# Altium project Blue Tractor_v1.1-2021.PrjPCB (part 1 of 2)
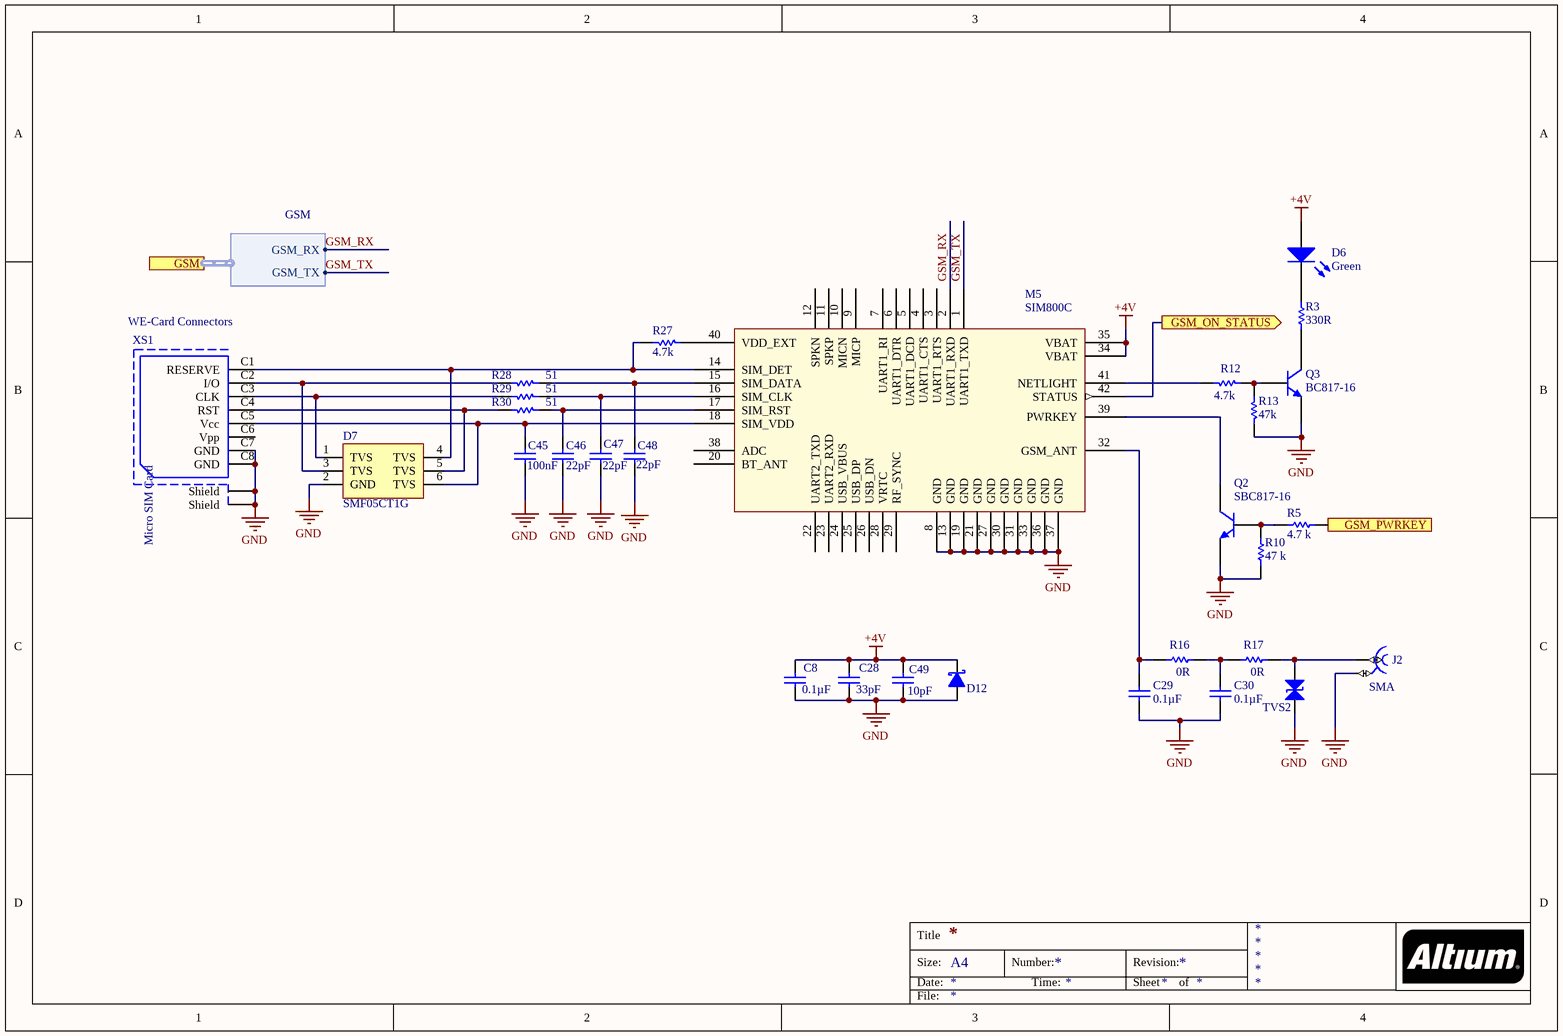
[diagram p0: [02] - GSM.SchDoc]
7 sheets, 95 parts. Net scope: global (net labels, ports and power ports of the same name join across sheets).
Board file: Blue Tractor_v3.3-2022.PcbDoc
Sheets:
  [02] - GSM.SchDoc
  [03] - WiFi.SchDoc
  [05] - Sensors.SchDoc
  [06] - IO_Ports.SchDoc
  [07] - SD.SchDoc
  [09] - EMC-Power.SchDoc
  [12] - RTC.SchDoc

## Sheet [02] - GSM.SchDoc
size A4

### Parts
C8  Capacitance: 0.1µF  [0603_C]  (hidden comment: Capacitor)
C28  Capacitance: 33pF  [0603_C]  (hidden comment: Capacitor)
C29  Capacitance: 0.1µF  [0603_C]  (hidden comment: Capacitor)
C30  Capacitance: 0.1µF  [0603_C]  (hidden comment: Capacitor)
C45  Capacitance: 100nF  [0603_C]  (hidden comment: Capacitor)
C46  Capacitance: 22pF  [0603_C]  (hidden comment: Capacitor)
C47  Capacitance: 22pF  [0603_C]  (hidden comment: Capacitor)
C48  Capacitance: 22pF  [0603_C]  (hidden comment: Capacitor)
C49  Capacitance: 10pF  [0603_C]  (hidden comment: Capacitor)
D6  Colour: Green  [Led 0805 green]  (hidden comment: LED)
D7  SMF05CT1G  [? TVS SMF05CT]
D12  D Schottky_1  [SOD-323]  (value not drawn)
J2  SMA  [AMPHENOL_132134]
M5  SIM800C  [GSM SIM800C]
Q2  SBC817-16  [SOT23-3]
Q3  BC817-16  [SOT23-3]
R3  Resistance: 330R  [0603_R]  (hidden comment: Res1)
R5  Resistance: 4.7 k  [0603_R]  (hidden comment: Res1)
R10  Resistance: 47 k  [0603_R]  (hidden comment: Res1)
R12  Resistance: 4.7k  [0603_R]  (hidden comment: Res1)
R13  Resistance: 47k  [0603_R]  (hidden comment: Res1)
R16  Resistance: 0R  [0603_R]  (hidden comment: Res1)
R17  Resistance: 0R  [0603_R]  (hidden comment: Res1)
R27  Resistance: 4.7k  [0603_R]  (hidden comment: Res1)
R28  Resistance: 51  [0603_R]  (hidden comment: Res1)
R29  Resistance: 51  [0603_R]  (hidden comment: Res1)
R30  Resistance: 51  [0603_R]  (hidden comment: Res1)
TVS2  LXE15AAA1-153  [LXES15_MUR-L]  (value not drawn)
XS1  WE-Card Connectors  [693022010811]

### Ports
GSM (harness GSM), GSM_ON_STATUS (out), GSM_PWRKEY (in)

### Harnesses
GSM: GSM_RX, GSM_TX

### Nets
+4V: C8.2 C28.2 C49.2 D6.1(A) D12.1(K) M5.34(VBAT) M5.35(VBAT)
GND: C8.1 C28.1 C29.1 C30.1 C45.1 C46.1 C47.1 C48.1 C49.1 D7.2(GND) D12.2(A) J2.2 M5.8(GND) M5.13(GND) M5.19(GND) M5.21(GND) M5.27(GND) M5.30(GND) M5.31(GND) M5.33(GND) M5.36(GND) M5.37(GND) Q2.2(E) Q3.2(E) R10.1 R13.1 TVS2.1 XS1.C7(GND) XS1.C8(GND) XS1.Z1(Shield) XS1.Z2(Shield)
GSM_RX: M5.2(UART1_RXD) ; port GSM.GSM_RX
GSM_TX: M5.1(UART1_TXD) ; port GSM.GSM_TX
NetC29_2: C29.2 M5.32(GSM_ANT) R16.2
NetC30_2: C30.2 R16.1 R17.2
NetC45_2: C45.2 D7.6(TVS) M5.18(SIM_VDD) XS1.C5(Vcc)
NetC46_2: C46.2 M5.17(SIM_RST) R30.1
NetC47_2: C47.2 M5.16(SIM_CLK) R29.1
NetC48_2: C48.2 M5.15(SIM_DATA) R28.1
NetD6_2: D6.2(K) R3.2
NetD7_1: D7.1(TVS) R29.2 XS1.C3(CLK)
NetD7_3: D7.3(TVS) R28.2 XS1.C2(I/O)
NetD7_4: D7.4(TVS) M5.14(SIM_DET) R27.2 XS1.C1(RESERVE)
NetD7_5: D7.5(TVS) R30.2 XS1.C4(RST)
NetJ2_1: J2.1 R17.1 TVS2.2
NetM5_39: M5.39(PWRKEY) Q2.3(C)
NetM5_40: M5.40(VDD_EXT) R27.1
NetM5_41: M5.41(NETLIGHT) R12.1
NetM5_42: M5.42(STATUS) ; port GSM_ON_STATUS
NetQ2_1: Q2.1(B) R5.1 R10.2
NetQ3_1: Q3.1(B) R12.2 R13.2
NetQ3_3: Q3.3(C) R3.1
NetR5_2: R5.2 ; port GSM_PWRKEY

Not connected (* = marked no-connect by the designer): M5 3(UART1_RTS) 4(UART1_CTS) 5(UART1_DCD) 6(UART1_DTR) 7(UART1_RI) 9(MICP) 10(MICN) 11(SPKP) 12(SPKN) 20(BT_ANT) 22(UART2_TXD) 23(UART2_RXD) 24(USB_VBUS) 25(USB_DP) 26(USB_DN) 28(VRTC) 29(RF_SYNC) 38(ADC); XS1 C6(Vpp)

### Notes on the sheet
- Title
- Size:
- Date:
- A4
- Number:
- Time:
- Revision:
- Sheet
- of
- File:
- (in symbol WE-Card Connectors 693022010811) Micro SIM Card

### Library data of the parts
C8 C28-C30 C45-C49 = 1: Chip Capacitor Nonpolar; Manufacturer: Kemet; Manufacturer Part Number: C0603C104K5RACTU; Tolerance: ±10%; Voltage - Rated: 50V; Temperature Coefficient: X7R; Supplier 1: Digi-Key; Supplier Part Number 1: 399-5089-1-ND; RoHS: RoHS Compliant; Category: Capacitors; Stock 1: 3992655; Pricing 1: 1=0.1, 10=0.041, 50=0.0222, 100=0.0187, 250=0.01532, 500=0.0131, 1000=0.0102 (USD); Packaging: Cut Tape (CT); Mounting Type: Surface Mount, MLCC; Operating Temperature: -55°C ~ 125°C; Applications: General Purpose; Ratings: -; Package / Case: 0603 (1608 Metric); Size / Dimension: 0.063" L x 0.031" W (1.60mm x 0.80mm); Height - Seated (Max): -; Thickness (Max): 0.034" (0.87mm); Lead Spacing: -; Features: -; Lead Style: -; ComponentLink1URL: http://www.kemet.com/docfinder?Partnumber=C0603C104K5RACTU; ComponentLink1Description: http://www.kemet.com/docfinder?Partnumber=C0603C104K5RACTU
D6 = 3: Led 0805; Manufacturer: Vishay Lite-On; Manufacturer Part Number: LTST-S220GKT; ID: 3; Lens Colour: Clear,Colorless; Viewing Angle: 130°; Lens Style: Clear,Diffused,Colorless,Rectangular; Luminous Intensity: 10mcd; Forward Voltage: 2.1V; Forward Current: 30mA; Power Rating: 100mW; Dominant Wavelength: 569nm; Test Current: 20mA; Lens Transparency: Clear; Number of Elements: 1; Wavelength: 565nm; Reverse Voltage: 5V; Supplier 1: Digi-Key; Supplier Part Number 1: 160-1218-6-ND; Stock 1: 87001; Pricing 1: 1=0.27, 10=0.199, 25=0.1464, 100=0.1045, 250=0.07108, 500=0.0627, 1000=0.04912 (USD); Mount: Surface Mount; Case/Package: 0805; Number of Pins: 2; Case Code (Metric): 2012; Case Code (Imperial): 0805; Min Operating Temperature: -55°C; Max Operating Temperature: 85°C; Package Quantity: 1; Packaging: Tape and Reel; Illumination Colour: Green; Power Dissipation: 100mW; Number of LEDs: 1; Length: 2.1mm; Height: 0.6mm; Width: 1mm; Depth: 0.6mm; Radiation Hardening: No; Lead Free: Lead Free; ComponentLink1URL: https://datasheet.ciiva.com/2110/ltst-s220gkt-2110016.pdf; ComponentLink1Description: https://datasheet.ciiva.com/2110/ltst-s220gkt-2110016.pdf; ComponentLink2URL: https://datasheet.ciiva.com/11775/0900766b80dc0b6e-11775442.pdf; ComponentLink2Description: https://datasheet.ciiva.com/11775/0900766b80dc0b6e-11775442.pdf; ComponentLink3URL: https://datasheet.ciiva.com/15118/getdatasheetpartid-221136-15118117.pdf; ComponentLink3Description: https://datasheet.ciiva.com/15118/getdatasheetpartid-221136-15118117.pdf; ComponentLink4URL: https://datasheet.ciiva.com/2110/ltst-s220gkt-2110017.pdf; ComponentLink4Description: https://datasheet.ciiva.com/2110/ltst-s220gkt-2110017.pdf; ComponentLink5URL: https://datasheet.ciiva.com/16444/ltst-s220gkt-16444773.pdf; ComponentLink5Description: https://datasheet.ciiva.com/16444/ltst-s220gkt-16444773.pdf
D7 = SMF05CT1G: 5-Line Transient Voltage  Suppressor Array; Manufacturer: ON Semiconductor; Type: Zener; Unidirectional Channels: 5; Voltage - Reverse Standoff (Typ): 5V (Max); Voltage - Breakdown (Min): 6.2V; Voltage - Clamping (Max) @ Ipp: 12.5V; Current - Peak Pulse (10/1000µs): 8A (8/20µs); Power - Peak Pulse: 100W; Power Line Protection: No; Capacitance @ Frequency: 80pF @ 1MHz; Supplier 1: Digi-Key; Supplier Part Number 1: SMF05CT1GOSCT-ND; Manufacturer Part Number: SMF05CT1G; RoHS: RoHS Compliant; Category: Circuit Protection; Stock 1: 13951; Pricing 1: 1=0.59, 10=0.413, 25=0.3392, 100=0.2709, 250=0.19736, 500=0.16026, 1000=0.12319 (USD); Packaging: Cut Tape (CT); Bidirectional Channels: -; Applications: General Purpose; Operating Temperature: -40°C ~ 125°C; Mounting Type: Surface Mount; Package / Case: 6-TSSOP, SC-88, SOT-363; Supplier Device Package: SC-88/SC70-6/SOT-363; ComponentLink1URL: http://www.onsemi.com/pub_link/Collateral/SMF05C-D.PDF; ComponentLink1Description: http://www.onsemi.com/pub_link/Collateral/SMF05C-D.PDF
D12 = D Schottky_1: SMAZ16-13-F; Manufacturer: Diodes Incorporated; Pd - Power Dissipation: 1 W; Vz - Zener Voltage: 16 V; Zener Current: 0.5 uA; Manufacturer Part Number: SMAZ16-13-F; Maximum Operating Temperature: + 150 C; Minimum Operating Temperature: - 65 C; Package / Case: SMA-2; Mounting Style: SMD/SMT; Product Category: Zener Diodes; Supplier Part Number: SMAZ16-FDICT-ND
J2 = AMPHENOL_132134: Manufacturer: TE Connectivity; Manufacturer Part Number: 5-1814832-1; Body Material: Zinc; Plating: Nickel; Body Plating: Gold; Dielectric Material: PTFE; Impedance: 50R; Frequency: 3GHz; Gender: Female; Connector Type: Jack,SMA; Polarity: Normal; Wire/Cable Type: Coaxial; Insulation Resistance: 5GR; Connector System: Cable-to-Board; Number of Positions: 1; Sealable: No (Without); Tail Length: 4mm; Family: SMA; Author: CERN DEM JLC; Supplier 1: Digi-Key; Supplier Part Number 1: A97594-ND; Stock 1: 20161; Pricing 1: 1=2.21, 10=2.121, 25=1.944, 50=1.8556, 100=1.7673, 250=1.54636, 500=1.50218, 1000=1.32545 (USD); Mount: PCB,Through Hole; Case/Package: SMA; Contact Material: Bronze; Contact Plating: Gold; Insulation Material: Polytetrafluoroethylene; Min Operating Temperature: -67°C; Max Operating Temperature: 185°C; Package Quantity: 1; Fastening Type: Threaded; Packaging: Box; Termination: Through Hole; Max Frequency: 3GHz; Orientation: Straight; Length: 0.532inch; Depth: 6.4mm; Radiation Hardening: No; REACH SVHC: No SVHC; Lead Free: Lead Free; ELV: Compliant
M5 = SIM800C: GSM/GPS module
Q2 Q3 = BC817-16: NPN General-purpose Transistor; Manufacturer: ON Semiconductor; Manufacturer Part Number: BC817-16LT3G; hFE Min: 100; Max Power Dissipation: 300mW; Collector Emitter Voltage (VCEO): 45V; Max Collector Current: 500mA; Transition Frequency: 100MHz; Collector Base Voltage (VCBO): 50V; Emitter Base Voltage (VEBO): 5V; Collector Emitter Saturation Voltage: 700mV; Element Configuration: Single; Number of Elements: 1; ComponentLink1URL: http://www.mccsemi.com/up_pdf/BC817-16~BC817-40(SOT-23).pdf; ComponentLink1Description: http://www.mccsemi.com/up_pdf/BC817-16~BC817-40(SOT-23).pdf; Supplier 1: Digi-Key; Supplier Part Number 1: BC817-16LT3GOSDKR-ND; Stock 1: 22032; Pricing 1: 1=0.13, 10=0.121, 100=0.0658, 500=0.04048, 1000=0.02759 (USD); Case/Package: SOT-23-3; Number of Pins: 3; Contact Plating: Tin,Matte; Min Operating Temperature: -55°C; Max Operating Temperature: 150°C; Package Quantity: 10000; Packaging: Tape and Reel; Collector Emitter Breakdown Voltage: 45V; Polarity: NPN; Power Dissipation: 300mW; Frequency: 100MHz; Max Breakdown Voltage: 45V; Gain Bandwidth Product: 100MHz; Radiation Hardening: No; Lead Free: Lead Free; Halogen Free: Halogen Free; ComponentLink2URL: https://datasheet.ciiva.com/15139/getdatasheetpartid-84401-15139109.pdf; ComponentLink2Description: https://datasheet.ciiva.com/15139/getdatasheetpartid-84401-15139109.pdf; ComponentLink3URL: https://datasheet.ciiva.com/980/bc817-16lt1-d-980715.pdf; ComponentLink3Description: https://datasheet.ciiva.com/980/bc817-16lt1-d-980715.pdf; ComponentLink4URL: https://datasheet.ciiva.com/26115/bc817-16lt1-d-26115598.pdf; ComponentLink4Description: https://datasheet.ciiva.com/26115/bc817-16lt1-d-26115598.pdf; ComponentLink5URL: https://datasheet.ciiva.com/11204/bc817-16lt1-d-11204335.pdf; ComponentLink5Description: https://datasheet.ciiva.com/11204/bc817-16lt1-d-11204335.pdf
R3 = Res1: Chip Resistor; Manufacturer: Panasonic; Manufacturer Part Number: ERJ-3GEYJ103V; Tolerance: 5%; Power Rating: 100mW; Voltage Rating: 75V; Temperature Coefficient: 200ppm/°C; Voltage Rating (DC): 50V; Supplier 1: Digi-Key; Supplier Part Number 1: P10KGDKR-ND; Stock 1: 10740434; Pricing 1: 1=0.1, 10=0.054, 100=0.022, 1000=0.00988, 2500=0.00858 (USD); Mount: Surface Mount; Case/Package: 0603; Weight: 7.1E-05oz; Case Code (Imperial): 0603; Case Code (Metric): 1608; Contact Plating: Tin; Min Operating Temperature: -55°C; Max Operating Temperature: 155°C; Packaging: Tape and Reel; Package Quantity: 1; Composition: Thick Film; Termination: SMD/SMT; Number of Terminations: 2; Military Standard: Not; Max Power Dissipation: 100mW; Working Voltage: 75V; Features: Automotive AEC-Q200; Length: 1.6mm; Height: 0.45mm; Width: 0.8mm; Depth: 0.8mm; REACH SVHC: No SVHC; Lead Free: Lead Free; ComponentLink1URL: https://datasheet.ciiva.com/34303/2007265-34303757.pdf; ComponentLink1Description: https://datasheet.ciiva.com/34303/2007265-34303757.pdf; ComponentLink2URL: https://datasheet.ciiva.com/11809/0900766b80f806dd-11809566.pdf; ComponentLink2Description: https://datasheet.ciiva.com/11809/0900766b80f806dd-11809566.pdf; ComponentLink3URL: https://datasheet.ciiva.com/28514/1678796-28514213.pdf; ComponentLink3Description: https://datasheet.ciiva.com/28514/1678796-28514213.pdf; ComponentLink4URL: https://datasheet.ciiva.com/30147/4aoa0000ce1-30147029.pdf; ComponentLink4Description: https://datasheet.ciiva.com/30147/4aoa0000ce1-30147029.pdf; ComponentLink5URL: https://datasheet.ciiva.com/46371/1678796-46371909.pdf; ComponentLink5Description: https://datasheet.ciiva.com/46371/1678796-46371909.pdf; ComponentLink6URL: https://datasheet.ciiva.com/24133/aoa0000ce1-37422-24133064.pdf; ComponentLink6Description: https://datasheet.ciiva.com/24133/aoa0000ce1-37422-24133064.pdf; ComponentLink7URL: https://datasheet.ciiva.com/46385/1678796-46385240.pdf; ComponentLink7Description: https://datasheet.ciiva.com/46385/1678796-46385240.pdf; ComponentLink8URL: https://datasheet.ciiva.com/17212/aoa0000ce1-17212106.pdf; ComponentLink8Description: https://datasheet.ciiva.com/17212/aoa0000ce1-17212106.pdf; ComponentLink9URL: https://datasheet.ciiva.com/9117/aoa0000ce1-9117038.pdf; ComponentLink9Description: https://datasheet.ciiva.com/9117/aoa0000ce1-9117038.pdf; ComponentLink10URL: https://datasheet.ciiva.com/16740/aoa0000ce1-16740655.pdf; ComponentLink10Description: https://datasheet.ciiva.com/16740/aoa0000ce1-16740655.pdf; ComponentLink11URL: https://datasheet.ciiva.com/48531/aoa0000ce1-48531887.pdf; ComponentLink11Description: https://datasheet.ciiva.com/48531/aoa0000ce1-48531887.pdf
R5 R10 = 1: Chip Resistor; Manufacturer: Panasonic; Manufacturer Part Number: ERJ-3GEYJ103V; Tolerance: 5%; Power Rating: 100mW; Voltage Rating: 75V; Temperature Coefficient: 200ppm/°C; Voltage Rating (DC): 50V; Supplier 1: Digi-Key; Supplier Part Number 1: P10KGDKR-ND; Stock 1: 10740434; Pricing 1: 1=0.1, 10=0.054, 100=0.022, 1000=0.00988, 2500=0.00858 (USD); Mount: Surface Mount; Case/Package: 0603; Weight: 7.1E-05oz; Case Code (Imperial): 0603; Case Code (Metric): 1608; Contact Plating: Tin; Min Operating Temperature: -55°C; Max Operating Temperature: 155°C; Packaging: Tape and Reel; Package Quantity: 1; Composition: Thick Film; Termination: SMD/SMT; Number of Terminations: 2; Military Standard: Not; Max Power Dissipation: 100mW; Working Voltage: 75V; Features: Automotive AEC-Q200; Length: 1.6mm; Height: 0.45mm; Width: 0.8mm; Depth: 0.8mm; REACH SVHC: No SVHC; Lead Free: Lead Free; ComponentLink1URL: https://datasheet.ciiva.com/34303/2007265-34303757.pdf; ComponentLink1Description: https://datasheet.ciiva.com/34303/2007265-34303757.pdf; ComponentLink2URL: https://datasheet.ciiva.com/11809/0900766b80f806dd-11809566.pdf; ComponentLink2Description: https://datasheet.ciiva.com/11809/0900766b80f806dd-11809566.pdf; ComponentLink3URL: https://datasheet.ciiva.com/28514/1678796-28514213.pdf; ComponentLink3Description: https://datasheet.ciiva.com/28514/1678796-28514213.pdf; ComponentLink4URL: https://datasheet.ciiva.com/30147/4aoa0000ce1-30147029.pdf; ComponentLink4Description: https://datasheet.ciiva.com/30147/4aoa0000ce1-30147029.pdf; ComponentLink5URL: https://datasheet.ciiva.com/46371/1678796-46371909.pdf; ComponentLink5Description: https://datasheet.ciiva.com/46371/1678796-46371909.pdf; ComponentLink6URL: https://datasheet.ciiva.com/24133/aoa0000ce1-37422-24133064.pdf; ComponentLink6Description: https://datasheet.ciiva.com/24133/aoa0000ce1-37422-24133064.pdf; ComponentLink7URL: https://datasheet.ciiva.com/46385/1678796-46385240.pdf; ComponentLink7Description: https://datasheet.ciiva.com/46385/1678796-46385240.pdf; ComponentLink8URL: https://datasheet.ciiva.com/17212/aoa0000ce1-17212106.pdf; ComponentLink8Description: https://datasheet.ciiva.com/17212/aoa0000ce1-17212106.pdf; ComponentLink9URL: https://datasheet.ciiva.com/9117/aoa0000ce1-9117038.pdf; ComponentLink9Description: https://datasheet.ciiva.com/9117/aoa0000ce1-9117038.pdf; ComponentLink10URL: https://datasheet.ciiva.com/16740/aoa0000ce1-16740655.pdf; ComponentLink10Description: https://datasheet.ciiva.com/16740/aoa0000ce1-16740655.pdf; ComponentLink11URL: https://datasheet.ciiva.com/48531/aoa0000ce1-48531887.pdf; ComponentLink11Description: https://datasheet.ciiva.com/48531/aoa0000ce1-48531887.pdf
R12 R13 R27-R30 = 1: Chip Resistor; Manufacturer: Panasonic; Manufacturer Part Number: ERJ-3EKF3300V; Tolerance: 1%; Power Rating: 100mW; Voltage Rating (DC): 75V; Temperature Coefficient: 100ppm/°C; ComponentLink1URL: http://industrial.panasonic.com/www-cgi/jvcr13pz.cgi?E+PZ+3+AOA0002+ERJ6ENF3000V+7+WW; ComponentLink1Description: http://industrial.panasonic.com/www-cgi/jvcr13pz.cgi?E+PZ+3+AOA0002+ERJ6ENF3000V+7+WW; Supplier 1: Digi-Key; Supplier Part Number 1: P330HDKR-ND; Stock 1: 924496; Pricing 1: 1=0.1, 10=0.079, 100=0.0323, 1000=0.01449, 2500=0.01258 (USD); Mount: Surface Mount; Case/Package: 0603; Number of Pins: 2; Weight: 7.1E-05oz; Case Code (Imperial): 0603; Case Code (Metric): 1608; Contact Plating: Tin; Min Operating Temperature: -55°C; Max Operating Temperature: 155°C; Packaging: Tape and Reel; Voltage Rating: 75V; Package Quantity: 1; Composition: Thick Film; Termination: SMD/SMT; Number of Terminations: 2; Military Standard: Not; Max Power Dissipation: 100mW; Features: Automotive AEC-Q200; Length: 1.6mm; Height: 0.022inch; Width: 0.8mm; Depth: 0.8mm; Radiation Hardening: No; REACH SVHC: No SVHC; Lead Free: Lead Free; ComponentLink2URL: https://datasheet.ciiva.com/7886/aoa0000ce2-7886729.pdf; ComponentLink2Description: https://datasheet.ciiva.com/7886/aoa0000ce2-7886729.pdf; ComponentLink3URL: https://datasheet.ciiva.com/48531/aoa0000ce2-48531001.pdf; ComponentLink3Description: https://datasheet.ciiva.com/48531/aoa0000ce2-48531001.pdf; ComponentLink4URL: https://datasheet.ciiva.com/22721/426256-22721099.pdf; ComponentLink4Description: https://datasheet.ciiva.com/22721/426256-22721099.pdf; ComponentLink5URL: https://datasheet.ciiva.com/46373/1678782-46373899.pdf; ComponentLink5Description: https://datasheet.ciiva.com/46373/1678782-46373899.pdf; ComponentLink6URL: https://datasheet.ciiva.com/9117/aoa0000ce2-9117132.pdf; ComponentLink6Description: https://datasheet.ciiva.com/9117/aoa0000ce2-9117132.pdf; ComponentLink7URL: https://datasheet.ciiva.com/46373/1678782-46373900.pdf; ComponentLink7Description: https://datasheet.ciiva.com/46373/1678782-46373900.pdf
R16 R17 = 1: Chip Resistor; Manufacturer: Panasonic; Manufacturer Part Number: ERJ-3GEY0R00V; Power Rating: 100mW; Voltage Rating: 75V; Tolerance: 0%; Temperature Coefficient: 600ppm/°C; Voltage Rating (DC): 50V; Supplier 1: Digi-Key; Supplier Part Number 1: P0.0GDKR-ND; Stock 1: 19868266; Pricing 1: 1=0.1, 10=0.053, 25=0.038, 50=0.029, 100=0.0214, 250=0.01632, 500=0.01306, 1000=0.00962 (USD); Mount: Surface Mount; Case/Package: 0603; Case Code (Metric): 1608; Case Code (Imperial): 0603; Contact Plating: Tin; Min Operating Temperature: -55°C; Max Operating Temperature: 155°C; Packaging: Tape and Reel; Package Quantity: 1; Composition: Thick Film; Number of Terminations: 2; Termination: SMD/SMT; Military Standard: Not; Max Power Dissipation: 100mW; Features: Automotive AEC-Q200; Length: 1.6mm; Height: 0.45mm; Width: 0.031inch; Depth: 0.8mm; Radiation Hardening: No; REACH SVHC: No SVHC; Lead Free: Lead Free; ComponentLink1URL: https://datasheet.ciiva.com/27055/1935748-27055113.pdf; ComponentLink1Description: https://datasheet.ciiva.com/27055/1935748-27055113.pdf; ComponentLink2URL: https://datasheet.ciiva.com/11808/0900766b80f806dd-11808207.pdf; ComponentLink2Description: https://datasheet.ciiva.com/11808/0900766b80f806dd-11808207.pdf; ComponentLink3URL: https://datasheet.ciiva.com/48532/aoa0000ce1-48532165.pdf; ComponentLink3Description: https://datasheet.ciiva.com/48532/aoa0000ce1-48532165.pdf; ComponentLink4URL: https://datasheet.ciiva.com/43460/1678796-43460647.pdf; ComponentLink4Description: https://datasheet.ciiva.com/43460/1678796-43460647.pdf; ComponentLink5URL: https://datasheet.ciiva.com/28695/1678796-28695833.pdf; ComponentLink5Description: https://datasheet.ciiva.com/28695/1678796-28695833.pdf; ComponentLink6URL: https://datasheet.ciiva.com/5959/1678796-5959707.pdf; ComponentLink6Description: https://datasheet.ciiva.com/5959/1678796-5959707.pdf; ComponentLink7URL: https://datasheet.ciiva.com/16834/aoa0000ce1-16834828.pdf; ComponentLink7Description: https://datasheet.ciiva.com/16834/aoa0000ce1-16834828.pdf; ComponentLink8URL: https://datasheet.ciiva.com/17215/aoa0000ce1-17215388.pdf; ComponentLink8Description: https://datasheet.ciiva.com/17215/aoa0000ce1-17215388.pdf; ComponentLink9URL: https://datasheet.ciiva.com/46377/1678796-46377868.pdf; ComponentLink9Description: https://datasheet.ciiva.com/46377/1678796-46377868.pdf; ComponentLink10URL: https://datasheet.ciiva.com/30199/4aoa0000ce1-30199822.pdf; ComponentLink10Description: https://datasheet.ciiva.com/30199/4aoa0000ce1-30199822.pdf; ComponentLink11URL: https://datasheet.ciiva.com/9198/aoa0000ce1-9198975.pdf; ComponentLink11Description: https://datasheet.ciiva.com/9198/aoa0000ce1-9198975.pdf; ComponentLink12URL: https://datasheet.ciiva.com/16758/70255313-16758527.pdf; ComponentLink12Description: https://datasheet.ciiva.com/16758/70255313-16758527.pdf
TVS2 = TVS-LXE15AAA1-153
XS1 = WE-Card Connectors 693022010811: WR-CRD Micro SIM_Hinge_8 pins; Manufacturer: Würth Elektronik eiSos GmbH; ComponentLink1 Description: Manufacturer; ComponentLink2 Description: Datasheet; NoPins: 8; ComponentLink1URL: http://www.we-online.de; ComponentLink2URL: http://katalog.we-online.de/em/datasheet/693022010811.pdf; Created by: Karrer Zheng; Created Date: 10/20/2014; partNo: 693022010811

## Sheet [03] - WiFi.SchDoc
size A4
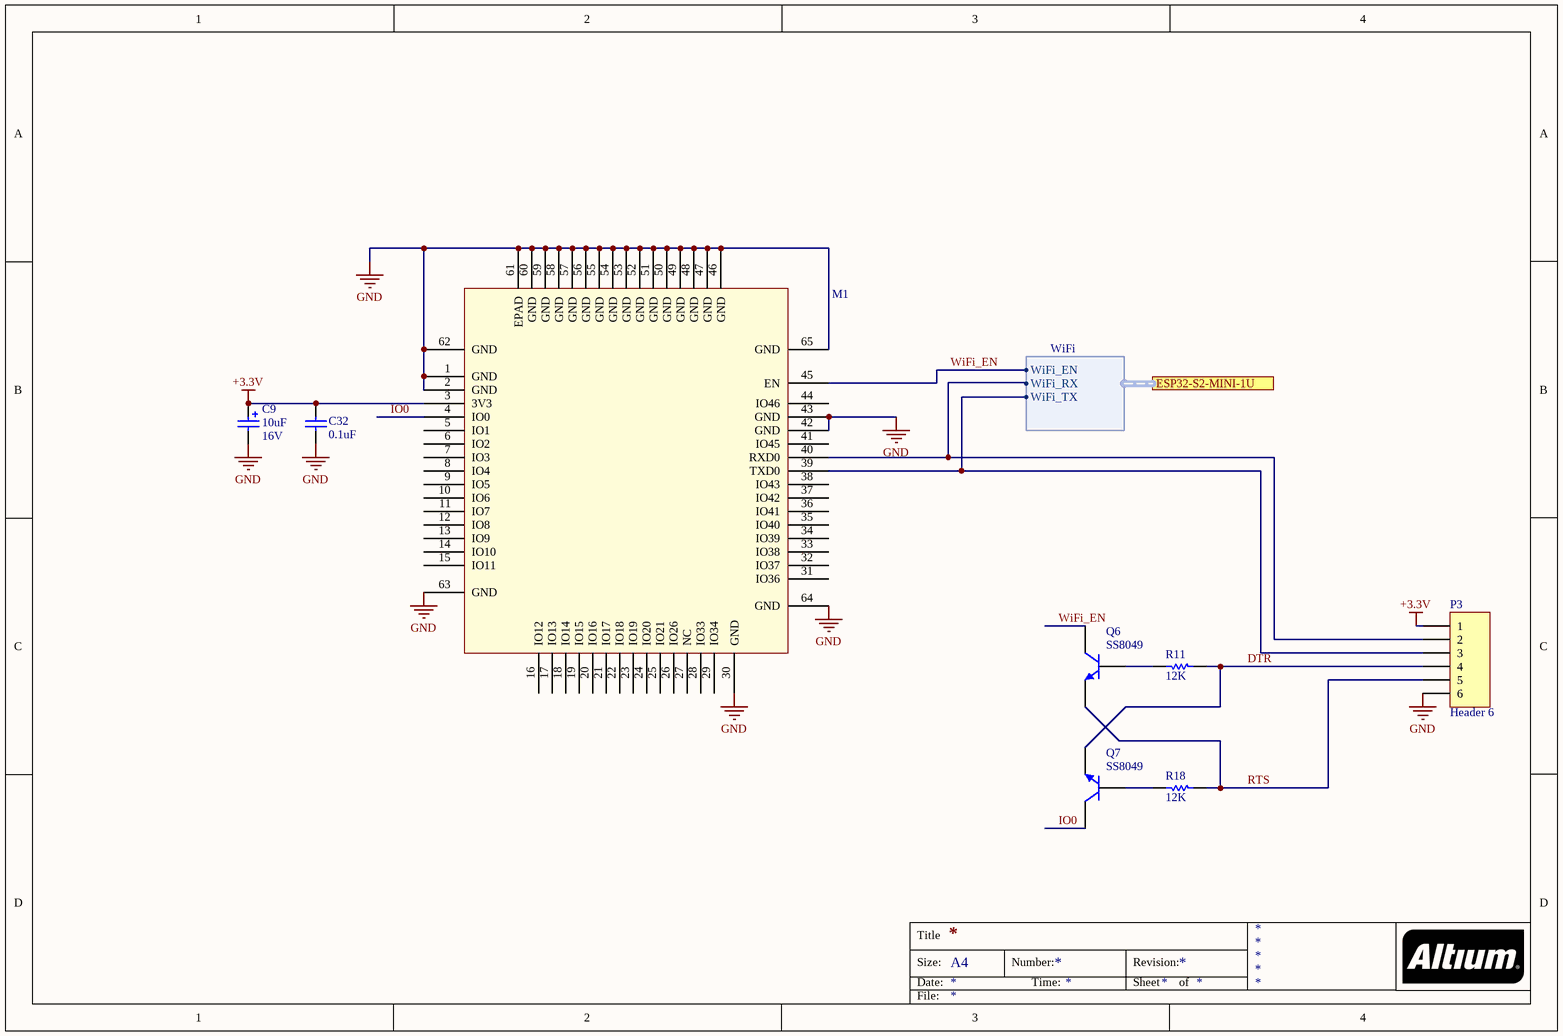
[diagram p1: [03] - WiFi.SchDoc]

### Parts
C9  Capacitance: 10uF  Voltage Rating: 16V  [Tantalum 3216 A]  (hidden comment: Capacitor Polarized)
C32  value 0.1uF  [0603_C]  (hidden comment: Cap)
M1  ESP32-S2-MINI-1U _Module  [ESP32-S2-MINI-1U]  (value not drawn)
P3  Header 6  [HDR1X6]
Q6  SS8049  [SOT23-3]
Q7  SS8049  [SOT23-3]
R11  Resistance: 12K  [Res-0603]  (hidden comment: Res1)
R18  Resistance: 12K  [Res-0603]  (hidden comment: Res1)

### Ports
ESP32-S2-MINI-1U (harness WiFi)

### Harnesses
WiFi: WiFi_EN, WiFi_RX, WiFi_TX

### Nets
+3.3V: C9.1 C32.2 M1.3(3V3) P3.1
GND: C9.2 C32.1 M1.1(GND) M1.2(GND) M1.30(GND) M1.42(GND) M1.43(GND) M1.46(GND) M1.47(GND) M1.48(GND) M1.49(GND) M1.50(GND) M1.51(GND) M1.52(GND) M1.53(GND) M1.54(GND) M1.55(GND) M1.56(GND) M1.57(GND) M1.58(GND) M1.59(GND) M1.60(GND) M1.61(EPAD) M1.62(GND) M1.63(GND) M1.64(GND) M1.65(GND) P3.6
DTR: P3.4 Q7.2(E) R11.2
IO0: M1.4(IO0) Q7.3(C)
RTS: P3.5 Q6.2(E) R18.2
WiFi_EN: M1.45(EN) Q6.3(C) ; port ESP32-S2-MINI-1U.WiFi_EN
NetM1_39: M1.39(TXD0) P3.3 ; port ESP32-S2-MINI-1U.WiFi_TX
NetM1_40: M1.40(RXD0) P3.2 ; port ESP32-S2-MINI-1U.WiFi_RX
NetQ6_1: Q6.1(B) R11.1
NetQ7_1: Q7.1(B) R18.1

Not connected (* = marked no-connect by the designer): M1 5(IO1) 6(IO2) 7(IO3) 8(IO4) 9(IO5) 10(IO6) 11(IO7) 12(IO8) 13(IO9) 14(IO10) 15(IO11) 16(IO12) 17(IO13) 18(IO14) 19(IO15) 20(IO16) 21(IO17) 22(IO18) 23(IO19) 24(IO20) 25(IO21) 26(IO26) 27(NC) 28(IO33) 29(IO34) 31(IO36) 32(IO37) 33(IO38) 34(IO39) 35(IO40) 36(IO41) 37(IO42) 38(IO43) 41(IO45) 44(IO46)

### Notes on the sheet
- Title
- Size:
- Date:
- A4
- Number:
- Time:
- Revision:
- Sheet
- of
- File:

### Library data of the parts
C9 = 2: CAP TANT 10UF 10% 16V 1206; Manufacturer: Vishay Sprague; Manufacturer Part Number: 293D106X9016A2TE3; Dielectric Material: Tantalum; ESR (Equivalent Series Resistance): 3R; Ripple Current: 160mA; Leakage Current: 1.6uA; Polarity: Polar; Dissipation Factor: 6%; Q Factor: 6; Supplier 1: Digi-Key; Supplier Part Number 1: 718-1123-1-ND; RoHS: Yes; Category: Tantalum Capacitors; Stock 1: 76138; Pricing 1: 1=0,54000, 10=0,38000, 50=0,28720, 100=0,25010, 500=0,18524, 1000=0,15745 (USD); Mount: Surface Mount,PCB; Case/Package: 1206; Case Code (Imperial): 1206; Case Code (Metric): 3216; Min Operating Temperature: -55°C; Max Operating Temperature: 125°C; Tolerance: 10%; Packaging: Tape and Reel; Package Quantity: 1; Voltage Rating (DC): 16V; Termination: SMD/SMT; Voltage: 16V; Features: General Purpose; Series: TANTAMOUNT® 293D; Length: 3.2mm; Width: 1.6mm; Height: 1.6mm; Height - Seated (Max): 0.071inch; Depth: 1.6mm; Radiation Hardening: No; REACH SVHC: Unknown; Lead Free: Lead Free; RoHS Compliant: Yes; ComponentLink1URL: https://datasheet.ciiva.com/11793/0900766b80d97b37-11793412.pdf?src-supplier=RSComponents; ComponentLink1Description: https://datasheet.ciiva.com/11793/0900766b80d97b37-11793412.pdf?src-supplier=RSComponents; ComponentLink2URL: https://datasheet.ciiva.com/257/293d-257982.pdf?src-supplier=Digi-Key; ComponentLink2Description: https://datasheet.ciiva.com/257/293d-257982.pdf?src-supplier=Digi-Key; ComponentLink3URL: https://datasheet.ciiva.com/257/293d-257983.pdf?src-supplier=Digi-Key; ComponentLink3Description: https://datasheet.ciiva.com/257/293d-257983.pdf?src-supplier=Digi-Key; ComponentLink4URL: https://datasheet.ciiva.com/1463/293d-1463155.pdf?src-supplier=Element14; ComponentLink4Description: https://datasheet.ciiva.com/1463/293d-1463155.pdf?src-supplier=Element14; ComponentLink5URL: https://datasheet.ciiva.com/3003/293d-3003829.pdf?src-supplier=Avnet; ComponentLink5Description: https://datasheet.ciiva.com/3003/293d-3003829.pdf?src-supplier=Avnet; ComponentLink6URL: https://datasheet.ciiva.com/16308/293d-16308277.pdf?src-supplier=Future+Electronics; ComponentLink6Description: https://datasheet.ciiva.com/16308/293d-16308277.pdf?src-supplier=Future+Electronics; ComponentLink7URL: https://datasheet.ciiva.com/22695/1910915-22695111.pdf?src-supplier=Element14; ComponentLink7Description: https://datasheet.ciiva.com/22695/1910915-22695111.pdf?src-supplier=Element14; ComponentLink8URL: https://datasheet.ciiva.com/257/293d-257981.pdf?src-supplier=Digi-Key; ComponentLink8Description: https://datasheet.ciiva.com/257/293d-257981.pdf?src-supplier=Digi-Key
C32 = Cap: Capacitor
M1 = ESP32-S2-MINI-1U _Module: Wi-Fi module; Datasheet: https://www.espressif.com/en/support/download/documents
P3 = Header 6: Header, 6-Pin; LatestRevisionDate: 17-Jul-2002; LatestRevisionNote: Re-released for DXP Platform.; Publisher: Altium Limited
Q6 Q7 = NPN: NPN Bipolar Transistor; Published: 8-Jun-2000; LatestRevisionDate: 17-Jul-2002; LatestRevisionNote: Re-released for DXP Platform.; PackageReference: TO-226-AA; Publisher: Altium Limited; PackageDescription: TO, Flat Index; 3 In-Line, Axial Leads; Body Dia. 4.8mm; Leads 0.55 x 0.51 mm (max); Code_JEDEC: TO-226-AA
R11 R18 = 1: Res Thkflm Anti-sulfurated 0603 100K Ohm 5% SMD; Manufacturer: Panasonic; Manufacturer Part Number: ERJ-U03J104V; Current Rating: 1A; Voltage Rating (DC): 75V; Power Rating: 100mW; Supplier 1: Digi-Key; Supplier Part Number 1: 10-ERJ-U03J104VCT-ND; Category: Chip SMD Resistors; Stock 1: 1856; Pricing 1: 1=0,10000, 10=0,07700, 100=0,02950, 1000=0,01298, 2500=0,01121 (USD); Case/Package: 0603; Weight: 7.1E-05oz; Case Code (Imperial): 0603; Case Code (Metric): 1608; Min Operating Temperature: -55°C; Max Operating Temperature: 155°C; Tolerance: 5%; Voltage Rating: 75V; Packaging: Tape and Reel; Package Quantity: 5000; Resistor Type: Thick Film; Termination: SMD/SMT; Length: 1.6mm; Width: 0.8mm; Height: 0.45mm; ComponentLink1URL: http://industrial.panasonic.com/www-cgi/jvcr13pz.cgi?E+PZ+3+AOA0005+ERJS06J821V+7+WW?src-supplier=Mouser; ComponentLink1Description: http://industrial.panasonic.com/www-cgi/jvcr13pz.cgi?E+PZ+3+AOA0005+ERJS06J821V+7+WW?src-supplier=Mouser; ComponentLink2URL: http://datasheet.octopart.com/ERJ-U03J104V-Panasonic-datasheet-61627662.pdf?src-supplier=Newark; ComponentLink2Description: http://datasheet.octopart.com/ERJ-U03J104V-Panasonic-datasheet-61627662.pdf?src-supplier=Newark; ComponentLink3URL: http://datasheet.octopart.com/ERJ-U03J104V-Panasonic-datasheet-33006993.pdf?src-supplier=Newark; ComponentLink3Description: http://datasheet.octopart.com/ERJ-U03J104V-Panasonic-datasheet-33006993.pdf?src-supplier=Newark; ComponentLink4URL: http://datasheet.octopart.com/ERJ-U03J104V-Panasonic-datasheet-78375410.pdf; ComponentLink4Description: http://datasheet.octopart.com/ERJ-U03J104V-Panasonic-datasheet-78375410.pdf

## Sheet [05] - Sensors.SchDoc
size A4
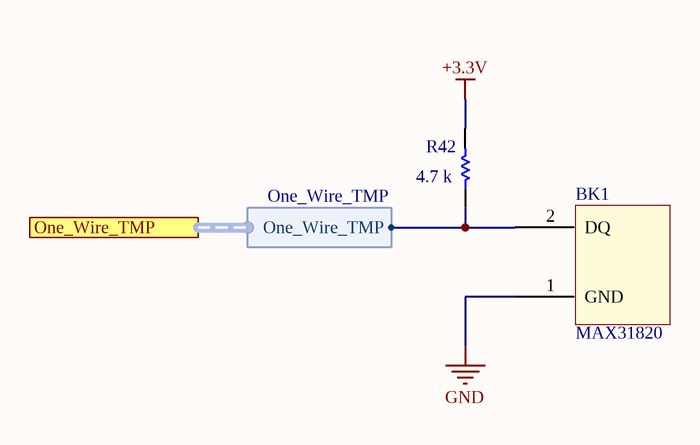
[diagram p2: [05] - Sensors.SchDoc]

### Parts
BK1  MAX31820  [TO92127P495H695-3]
R42  Resistance: 4.7 k  [0603_R]  (hidden comment: Res1)

### Ports
One_Wire_TMP (harness One_Wire_TMP)

### Harnesses
One_Wire_TMP: One_Wire_TMP

### Nets
+3.3V: R42.2
GND: BK1.1(GND)
NetBK1_2: BK1.2(DQ) R42.1 ; port One_Wire_TMP.One_Wire_TMP

### Notes on the sheet
- Title
- Size:
- Date:
- A4
- Number:
- Time:
- Revision:
- Sheet
- of
- File:

### Library data of the parts
BK1 = MAX31820: MAX31820PAR  temper sensor
R42 = 1: as R5 on sheet [02] - GSM; Supplier 1: Digi-Key; Supplier Part Number 1: P10KGDKR-ND; Stock 1: 10740434; Pricing 1: 1=0.1, 10=0.054, 100=0.022, 1000=0.00988, 2500=0.00858 (USD); Mount: Surface Mount; Case/Package: 0603; Weight: 7.1E-05oz; Case Code (Imperial): 0603; Case Code (Metric): 1608; Contact Plating: Tin; Min Operating Temperature: -55°C; Max Operating Temperature: 155°C; Packaging: Tape and Reel; Package Quantity: 1; Composition: Thick Film; Termination: SMD/SMT; Number of Terminations: 2; Military Standard: Not; Max Power Dissipation: 100mW; Working Voltage: 75V; Features: Automotive AEC-Q200; Length: 1.6mm; Height: 0.45mm; Width: 0.8mm; Depth: 0.8mm; REACH SVHC: No SVHC; Lead Free: Lead Free; ComponentLink1URL: https://datasheet.ciiva.com/34303/2007265-34303757.pdf; ComponentLink1Description: https://datasheet.ciiva.com/34303/2007265-34303757.pdf; ComponentLink2URL: https://datasheet.ciiva.com/11809/0900766b80f806dd-11809566.pdf; ComponentLink2Description: https://datasheet.ciiva.com/11809/0900766b80f806dd-11809566.pdf; ComponentLink3URL: https://datasheet.ciiva.com/28514/1678796-28514213.pdf; ComponentLink3Description: https://datasheet.ciiva.com/28514/1678796-28514213.pdf; ComponentLink4URL: https://datasheet.ciiva.com/30147/4aoa0000ce1-30147029.pdf; ComponentLink4Description: https://datasheet.ciiva.com/30147/4aoa0000ce1-30147029.pdf; ComponentLink5URL: https://datasheet.ciiva.com/46371/1678796-46371909.pdf; ComponentLink5Description: https://datasheet.ciiva.com/46371/1678796-46371909.pdf; ComponentLink6URL: https://datasheet.ciiva.com/24133/aoa0000ce1-37422-24133064.pdf; ComponentLink6Description: https://datasheet.ciiva.com/24133/aoa0000ce1-37422-24133064.pdf; ComponentLink7URL: https://datasheet.ciiva.com/46385/1678796-46385240.pdf; ComponentLink7Description: https://datasheet.ciiva.com/46385/1678796-46385240.pdf; ComponentLink8URL: https://datasheet.ciiva.com/17212/aoa0000ce1-17212106.pdf; ComponentLink8Description: https://datasheet.ciiva.com/17212/aoa0000ce1-17212106.pdf; ComponentLink9URL: https://datasheet.ciiva.com/9117/aoa0000ce1-9117038.pdf; ComponentLink9Description: https://datasheet.ciiva.com/9117/aoa0000ce1-9117038.pdf; ComponentLink10URL: https://datasheet.ciiva.com/16740/aoa0000ce1-16740655.pdf; ComponentLink10Description: https://datasheet.ciiva.com/16740/aoa0000ce1-16740655.pdf; ComponentLink11URL: https://datasheet.ciiva.com/48531/aoa0000ce1-48531887.pdf; ComponentLink11Description: https://datasheet.ciiva.com/48531/aoa0000ce1-48531887.pdf

## Sheet [06] - IO_Ports.SchDoc
size A4
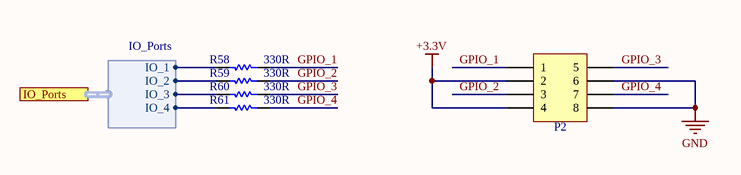
[diagram p3: [06] - IO_Ports.SchDoc]

### Parts
P2  Header 4X2A  [CON: PLD-2*4]  (value not drawn)
R58  Resistance: 330R  [0603_R]  (hidden comment: Res1)
R59  Resistance: 330R  [0603_R]  (hidden comment: Res1)
R60  Resistance: 330R  [0603_R]  (hidden comment: Res1)
R61  Resistance: 330R  [0603_R]  (hidden comment: Res1)

### Ports
IO_Ports (harness IO_Ports)

### Harnesses
IO_Ports: IO_1, IO_2, IO_3, IO_4

### Nets
+3.3V: P2.2 P2.4
GND: P2.6 P2.8
GPIO_1: P2.1 R58.2
GPIO_2: P2.3 R59.2
GPIO_3: P2.5 R60.2
GPIO_4: P2.7 R61.2
NetR58_1: R58.1 ; port IO_Ports.IO_1
NetR59_1: R59.1 ; port IO_Ports.IO_2
NetR60_1: R60.1 ; port IO_Ports.IO_3
NetR61_1: R61.1 ; port IO_Ports.IO_4

### Notes on the sheet
- Title
- Size:
- Date:
- A4
- Number:
- Time:
- Revision:
- Sheet
- of
- File:

### Library data of the parts
P2 = Header 4X2A: Header, 4-Pin, Dual row; LatestRevisionDate: 17-Jul-2002; LatestRevisionNote: Re-released for DXP Platform.; Publisher: Altium Limited
R58-R61 = 1: as R12 on sheet [02] - GSM; ComponentLink1URL: http://industrial.panasonic.com/www-cgi/jvcr13pz.cgi?E+PZ+3+AOA0002+ERJ6ENF3000V+7+WW; ComponentLink1Description: http://industrial.panasonic.com/www-cgi/jvcr13pz.cgi?E+PZ+3+AOA0002+ERJ6ENF3000V+7+WW; Supplier 1: Digi-Key; Supplier Part Number 1: P330HDKR-ND; Stock 1: 924496; Pricing 1: 1=0.1, 10=0.079, 100=0.0323, 1000=0.01449, 2500=0.01258 (USD); Mount: Surface Mount; Case/Package: 0603; Number of Pins: 2; Weight: 7.1E-05oz; Case Code (Imperial): 0603; Case Code (Metric): 1608; Contact Plating: Tin; Min Operating Temperature: -55°C; Max Operating Temperature: 155°C; Packaging: Tape and Reel; Voltage Rating: 75V; Package Quantity: 1; Composition: Thick Film; Termination: SMD/SMT; Number of Terminations: 2; Military Standard: Not; Max Power Dissipation: 100mW; Features: Automotive AEC-Q200; Length: 1.6mm; Height: 0.022inch; Width: 0.8mm; Depth: 0.8mm; Radiation Hardening: No; REACH SVHC: No SVHC; Lead Free: Lead Free; ComponentLink2URL: https://datasheet.ciiva.com/7886/aoa0000ce2-7886729.pdf; ComponentLink2Description: https://datasheet.ciiva.com/7886/aoa0000ce2-7886729.pdf; ComponentLink3URL: https://datasheet.ciiva.com/48531/aoa0000ce2-48531001.pdf; ComponentLink3Description: https://datasheet.ciiva.com/48531/aoa0000ce2-48531001.pdf; ComponentLink4URL: https://datasheet.ciiva.com/22721/426256-22721099.pdf; ComponentLink4Description: https://datasheet.ciiva.com/22721/426256-22721099.pdf; ComponentLink5URL: https://datasheet.ciiva.com/46373/1678782-46373899.pdf; ComponentLink5Description: https://datasheet.ciiva.com/46373/1678782-46373899.pdf; ComponentLink6URL: https://datasheet.ciiva.com/9117/aoa0000ce2-9117132.pdf; ComponentLink6Description: https://datasheet.ciiva.com/9117/aoa0000ce2-9117132.pdf; ComponentLink7URL: https://datasheet.ciiva.com/46373/1678782-46373900.pdf; ComponentLink7Description: https://datasheet.ciiva.com/46373/1678782-46373900.pdf

## Sheet [07] - SD.SchDoc
size A4
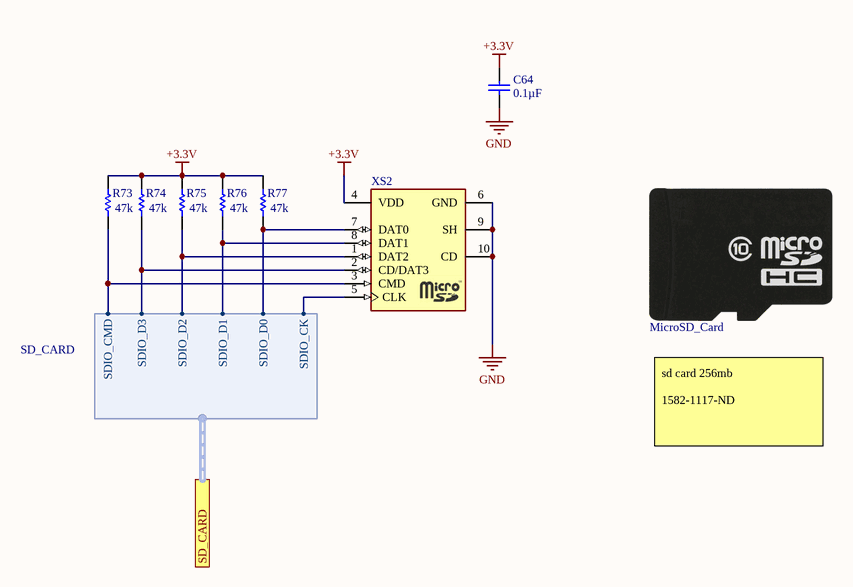
[diagram p4: [07] - SD.SchDoc]

### Parts
*1  MicroSD_Card  (mechanical)
C64  Capacitance: 0.1µF  [0603_C]  (hidden comment: Capacitor)
R73  Resistance: 47k  [0603_R]  (hidden comment: Res1)
R74  Resistance: 47k  [0603_R]  (hidden comment: Res1)
R75  Resistance: 47k  [0603_R]  (hidden comment: Res1)
R76  Resistance: 47k  [0603_R]  (hidden comment: Res1)
R77  Resistance: 47k  [0603_R]  (hidden comment: Res1)
XS2  (no value)  [MICROSD]

### Ports
SD_CARD (harness SD_CARD)

### Harnesses
SD_CARD: SDIO_CMD, SDIO_D0, SDIO_D1, SDIO_D2, SDIO_D3, SDIO_CK

### Nets
+3.3V: C64.2 R73.2 R74.2 R75.2 R76.2 R77.2 XS2.4(VDD)
GND: C64.1 XS2.6(GND) XS2.9(SH) XS2.10(CD)
NetR73_1: R73.1 XS2.3(CMD) ; port SD_CARD.SDIO_CMD
NetR74_1: R74.1 XS2.2(CD/DAT3) ; port SD_CARD.SDIO_D3
NetR75_1: R75.1 XS2.1(DAT2) ; port SD_CARD.SDIO_D2
NetR76_1: R76.1 XS2.8(DAT1) ; port SD_CARD.SDIO_D1
NetR77_1: R77.1 XS2.7(DAT0) ; port SD_CARD.SDIO_D0
NetXS2_5: XS2.5(CLK) ; port SD_CARD.SDIO_CK

### Notes on the sheet
- sd card 256mb
  1582-1117-ND
- Title
- Size:
- Date:
- A4
- Number:
- Time:
- Revision:
- Sheet
- of
- File:

### Library data of the parts
*1 = MicroSD_Card: Manufacturer: Apacer; Manufacturer Part Number: AP-MSD256ISI-1T; Supplier 1: Digi-Key; Supplier Part Number 1: 1582-1117-ND; Stock 1: 4143; Pricing 1: 1=12.85, 10=11.903, 25=11.6336, 50=11.5698, 100=10.1856, 250=9.68168, 500=9.5823, 1000=9.26289 (USD); ComponentLink1URL: http://www.mouser.com/ds/2/24/EDM_mSD(SLC)-957981.pdf; ComponentLink1Description: http://www.mouser.com/ds/2/24/EDM_mSD(SLC)-957981.pdf; ComponentLink2URL: http://eflash.apacerus.com/spec/Card/microSD/Consumer/EDM_mSD(SLC).pdf; ComponentLink2Description: http://eflash.apacerus.com/spec/Card/microSD/Consumer/EDM_mSD(SLC).pdf
C64 = 1: as C8 on sheet [02] - GSM; Supplier 1: Digi-Key; Supplier Part Number 1: 399-5089-1-ND; RoHS: RoHS Compliant; Category: Capacitors; Stock 1: 3992655; Pricing 1: 1=0.1, 10=0.041, 50=0.0222, 100=0.0187, 250=0.01532, 500=0.0131, 1000=0.0102 (USD); Packaging: Cut Tape (CT); Mounting Type: Surface Mount, MLCC; Operating Temperature: -55°C ~ 125°C; Applications: General Purpose; Ratings: -; Package / Case: 0603 (1608 Metric); Size / Dimension: 0.063" L x 0.031" W (1.60mm x 0.80mm); Height - Seated (Max): -; Thickness (Max): 0.034" (0.87mm); Lead Spacing: -; Features: -; Lead Style: -; ComponentLink1URL: http://www.kemet.com/docfinder?Partnumber=C0603C104K5RACTU; ComponentLink1Description: http://www.kemet.com/docfinder?Partnumber=C0603C104K5RACTU
R73-R77 = 1: Chip Resistor; Manufacturer: Panasonic; Manufacturer Part Number: ERJ-3EKF4702V; Tolerance: 1%; Power Rating: 100mW; Voltage Rating: 75V; Temperature Coefficient: 100ppm/°C; Working Voltage: 6V; Supplier 1: Digi-Key; Supplier Part Number 1: P47.0KHDKR-ND; Stock 1: 2918345; Pricing 1: 1=0.1, 10=0.079, 100=0.0323, 1000=0.01449, 2500=0.01258 (USD); Mount: Surface Mount; Case/Package: 0603; Number of Pins: 2; Case Code (Metric): 1608; Case Code (Imperial): 0603; Contact Plating: Tin; Min Operating Temperature: -55°C; Max Operating Temperature: 155°C; Packaging: Tape and Reel; Package Quantity: 1; Composition: Thick Film; Number of Terminations: 2; Termination: SMD/SMT; Military Standard: Not; Max Power Dissipation: 100mW; Voltage Rating (DC): 75V; Features: Automotive AEC-Q200; Length: 1.6mm; Height: 0.022inch; Width: 0.031inch; Depth: 0.8mm; Radiation Hardening: No; REACH SVHC: No SVHC; Lead Free: Lead Free; ComponentLink1URL: https://datasheet.ciiva.com/6138/aoa0000ce2-6138149.pdf; ComponentLink1Description: https://datasheet.ciiva.com/6138/aoa0000ce2-6138149.pdf; ComponentLink2URL: https://datasheet.ciiva.com/48531/aoa0000ce2-48531029.pdf; ComponentLink2Description: https://datasheet.ciiva.com/48531/aoa0000ce2-48531029.pdf; ComponentLink3URL: https://datasheet.ciiva.com/7802/aoa0000ce2-7802421.pdf; ComponentLink3Description: https://datasheet.ciiva.com/7802/aoa0000ce2-7802421.pdf; ComponentLink4URL: https://datasheet.ciiva.com/16514/aoa0000ce2-16514071.pdf; ComponentLink4Description: https://datasheet.ciiva.com/16514/aoa0000ce2-16514071.pdf; ComponentLink5URL: https://datasheet.ciiva.com/46398/1678782-46398088.pdf; ComponentLink5Description: https://datasheet.ciiva.com/46398/1678782-46398088.pdf; ComponentLink6URL: https://datasheet.ciiva.com/24069/aoa0000ce2-24069209.pdf; ComponentLink6Description: https://datasheet.ciiva.com/24069/aoa0000ce2-24069209.pdf; ComponentLink7URL: https://datasheet.ciiva.com/46398/1678782-46398089.pdf; ComponentLink7Description: https://datasheet.ciiva.com/46398/1678782-46398089.pdf; ComponentLink8URL: https://datasheet.ciiva.com/30236/aoa0000ce2-30236698.pdf; ComponentLink8Description: https://datasheet.ciiva.com/30236/aoa0000ce2-30236698.pdf; ComponentLink9URL: https://datasheet.ciiva.com/22722/426256-22722781.pdf; ComponentLink9Description: https://datasheet.ciiva.com/22722/426256-22722781.pdf; ComponentLink10URL: https://datasheet.ciiva.com/7802/1678782-7802686.pdf; ComponentLink10Description: https://datasheet.ciiva.com/7802/1678782-7802686.pdf; ComponentLink11URL: https://datasheet.ciiva.com/16758/70260748-16758831.pdf; ComponentLink11Description: https://datasheet.ciiva.com/16758/70260748-16758831.pdf
XS2 = MICROSD: =Description; Manufacturer: Molex; Manufacturer Part Number: 105162-0001; Connector Type: Connector; Max Voltage Rating (DC): 5V; Number of Contacts: 8; Pitch: 1.09mm; Supplier 1: Digi-Key; Supplier Part Number 1: WM14405DKR-ND; Stock 1: 9741; Pricing 1: 1=0.88, 10=0.774, 100=0.6677, 500=0.54628, 1000=0.48558 (USD); Mount: Surface Mount; Contact Material: Bronze; Contact Plating: Gold; Housing Material: Thermoplastic; Min Operating Temperature: -40°C; Max Operating Temperature: 85°C; Packaging: Tape and Reel; Number of Rows: 1; Package Quantity: 6000; Termination: Solder; Orientation: Right Angle; Number of Circuits: 8; Length: 11.3mm; Depth: 7.6mm; Radiation Hardening: No; ComponentLink1URL: https://datasheet.ciiva.com/29723/1051620101-sd-29723393.pdf; ComponentLink1Description: https://datasheet.ciiva.com/29723/1051620101-sd-29723393.pdf